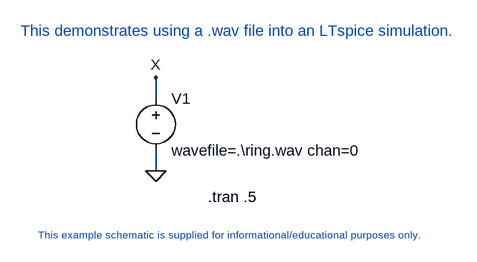
[diagram p0: schematic wavein.asc]
wavein.asc, the LTspice schematic file:
Version 4
SHEET 1 2236 1128
WIRE 1184 896 1184 864
WIRE 1184 1008 1184 976
FLAG 1184 1008 0
FLAG 1184 864 X
SYMBOL VOLTAGE 1184 880 R0
SYMATTR InstName V1
SYMATTR Value wavefile=.\ring.wav chan=0
TEXT 1264 1048 Left 2 !.tran .5
TEXT 1288 1096 Top 1 ;This example schematic is supplied for informational/educational purposes only.
TEXT 976 792 Left 2 ;This demonstrates using a .wav file into an LTspice simulation.

The netlist it stands for:
* wavein.asc
V1 X 0 wavefile=.\ring.wav chan=0
.tran .5
* This example schematic is supplied for informational/educational purposes only.
* This demonstrates using a .wav file into an LTspice simulation.
.backanno
.end